# Altium schematic sheet pressure gage.SchDoc
size A3
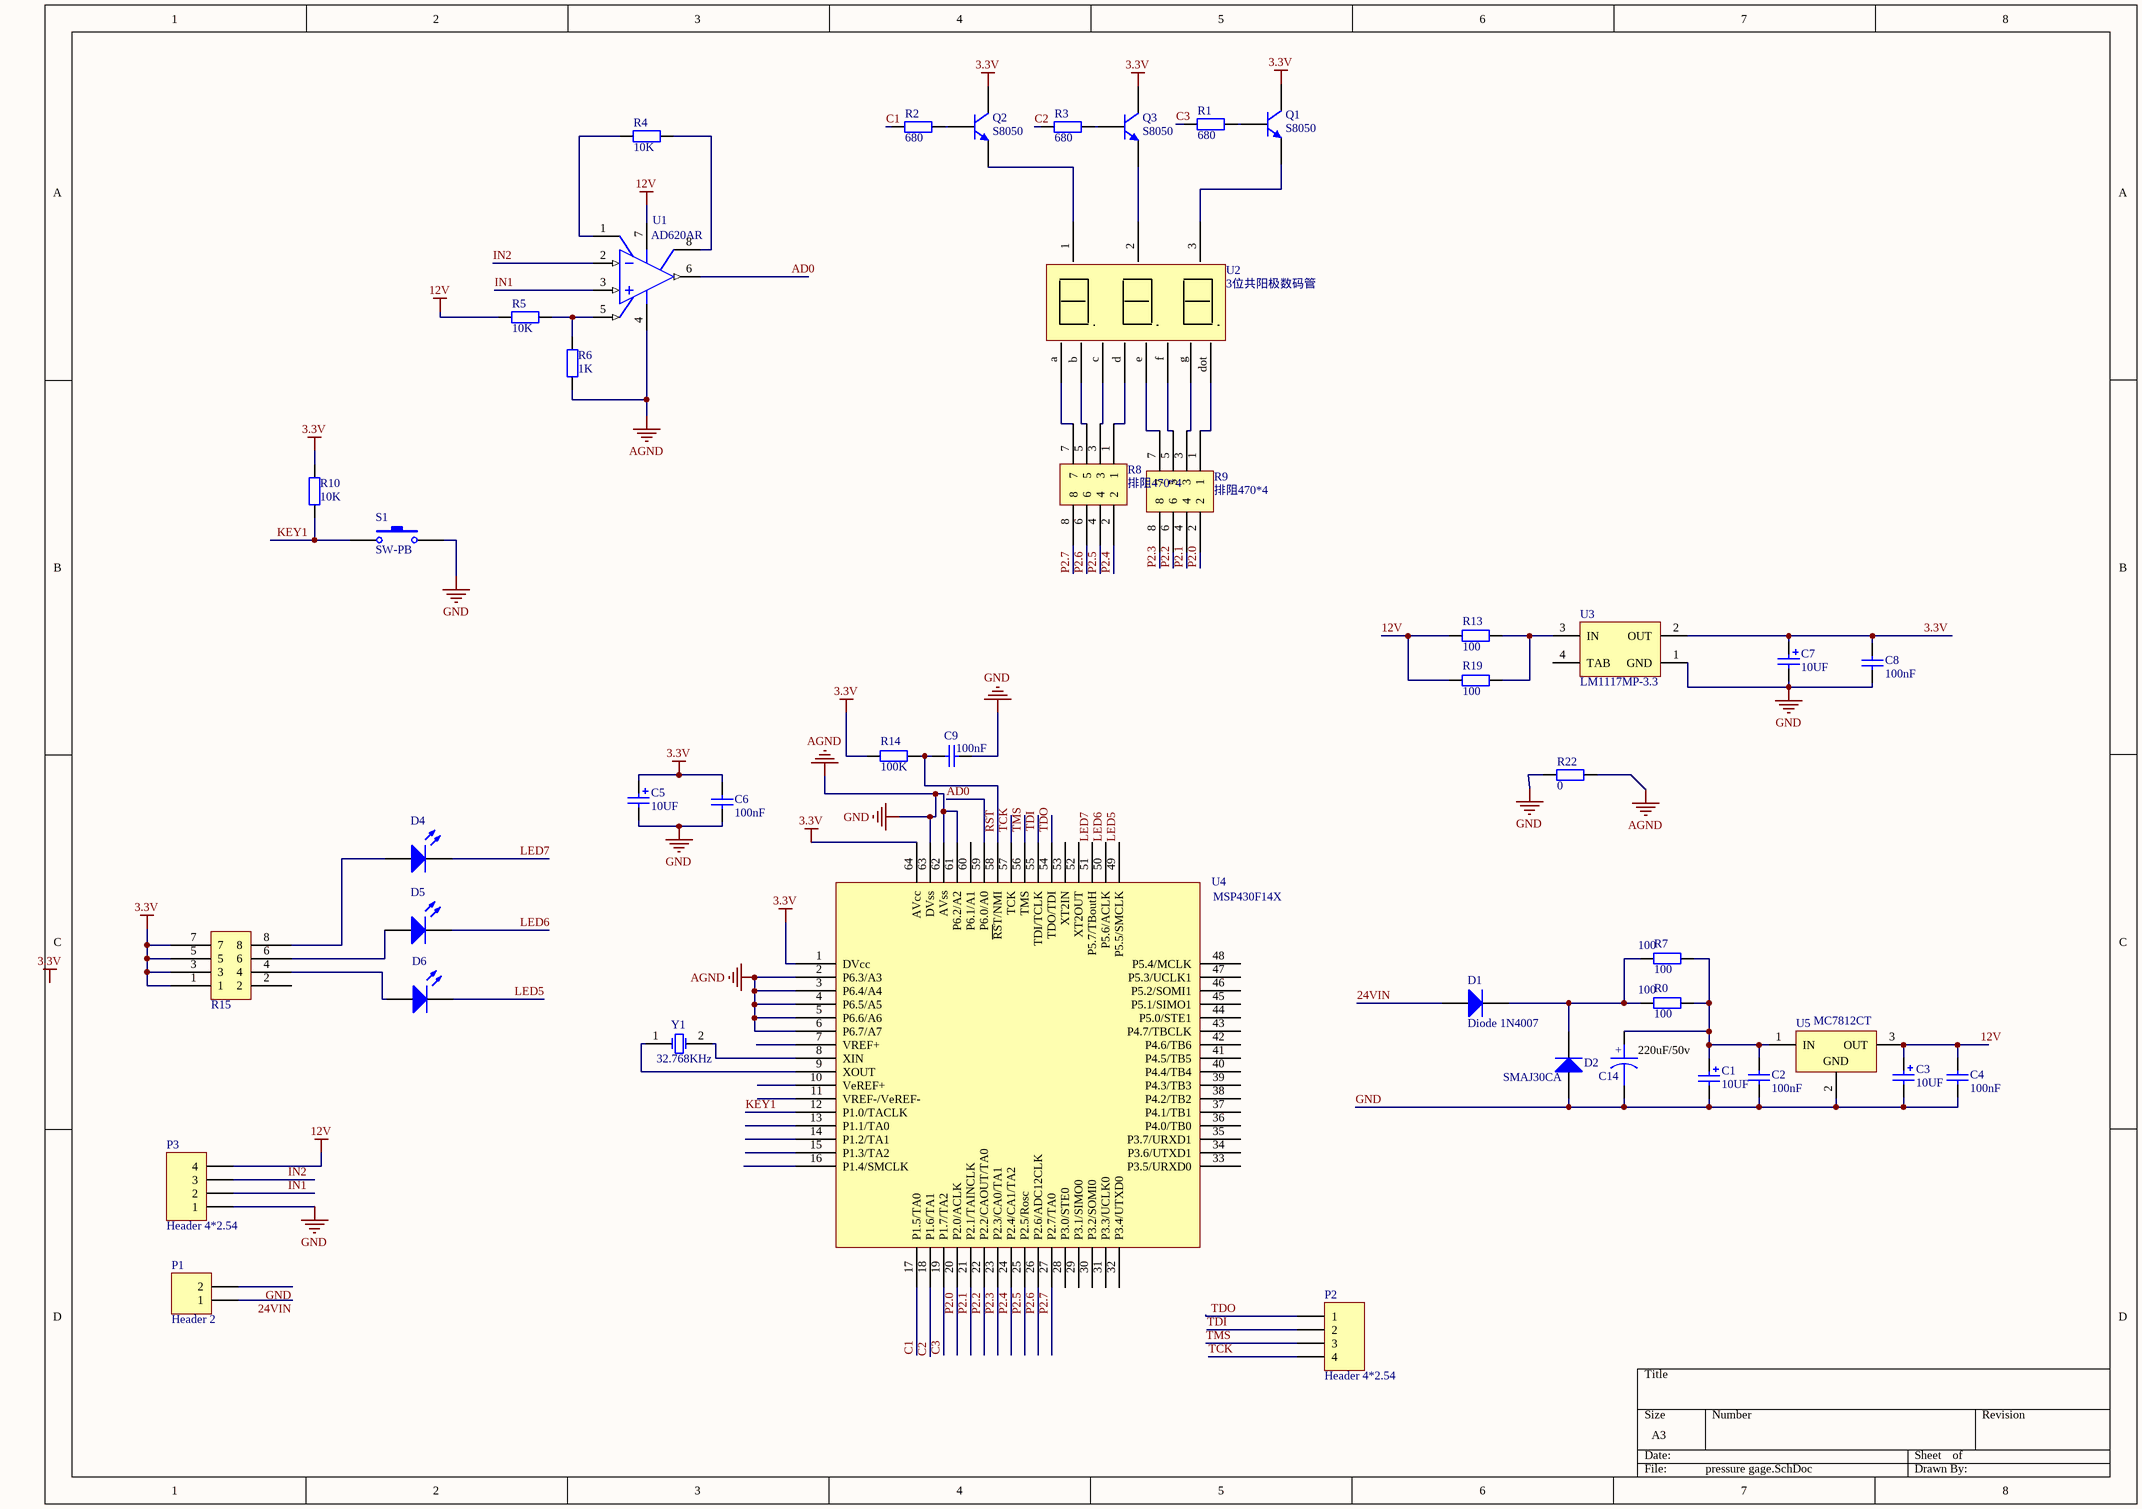
[diagram p0: pressure gage.SchDoc]

## Parts
C1  10uf  [3216]
C2  100nf  [0805_C_Y]
C3  10uf  [3216]
C4  100nf  [0805_C_Y]
C5  10uf  [3216]
C6  100nf  [0603AC]
C7  10uf  [3216]
C8  100nf  [0603AC]
C9  100nf  [0603AC]
C14  220uF/50v  [D50]
D1  Diode 1N4007  [DO-214]
D2  SMAJ30CA  [1812]
D4  LED  [LED]  (value not drawn)
D5  LED  [LED]  (value not drawn)
D6  LED  [LED]  (value not drawn)
P1  Header 2  [HDR1X2]
P2  Header 4*2.54  [HDR1X4]
P3  Header 4*2.54  [HDR1X4]
Q1  S8050  [SOT-23_Y]
Q2  S8050  [SOT-23_Y]
Q3  S8050  [SOT-23_Y]
R0  100  [1206]
R1  value 680  [0603AR]  (hidden comment: 330)
R2  value 680  [0603AR]  (hidden comment: 330)
R3  value 680  [0603AR]  (hidden comment: 330)
R4  10k  [0603AR]
R5  10k  [0603AR]
R6  1k  [0603AR]
R7  100  [1206]
R8  排阻470*4  [8P4R_0603]
R9  排阻470*4  [8P4R_0603]
R10  value 10K  [0603]  (hidden comment: 1k)
R13  100  [1206]
R14  100k  [0603AR]
R15  排阻470*4  [8P4R_0603]  (value not drawn)
R19  100  [1206]
R22  0  [0603AR]
S1  SW-PB  [SW-SMD1]
U1  AD620AR  [SO-8_Y]
U2  3位共阳极数码管  [3位数码管0.56]
U3  LM1117MP-3.3  [SOT89M]
U4  MSP430F14X  [S-PQFP-G64_Y]
U5  MC7812CT  [SOT89M]
Y1  value 32.768KHz  [Crastal_32.768_Y]  (hidden comment: 晶振32.768k)

## Nets
3.3V: C5.1 C6.1 C7.1 C8.1 Q1.3(C) Q2.3(C) Q3.3(C) R10.2 R14.1 R15.1 R15.3 R15.5 R15.7 U3.2(OUT) U4.1(DVcc) U4.64(AVcc)
12V: C3.1 C4.1 P3.4 R5.2 R13.1 R19.1 U1.7(V+) U5.3(OUT)
GND: C1.2 C2.2 C3.2 C4.2 C5.2 C6.2 C7.2 C8.2 C9.1 C14.2 D2.1(A) P1.2 P3.1 R6.1 R22.1 R22.2 S1.2 U1.4(V-) U3.1(GND) U4.2(P6.3/A3) U4.3(P6.4/A4) U4.4(P6.5/A5) U4.5(P6.6/A6) U4.6(P6.7/A7) U4.61(P6.2/A2) U4.62(AVss) U4.63(DVss) U5.2(GND)  [also labelled AGND]
24VIN: D1.1(A) P1.1
AD0: U1.6(OUT) U4.59(P6.0/A0)
C1: R2.2 U4.17(P1.5/TA0)
C2: R3.2 U4.18(P1.6/TA1)
C3: R1.2 U4.19(P1.7/TA2)
IN1: P3.2 U1.3(+IN)
IN2: P3.3 U1.2(-IN)
KEY1: R10.1 S1.1 U4.12(P1.0/TACLK)
LED5: D6.2(K) U4.49(P5.5/SMCLK)
LED6: D5.2(K) U4.50(P5.6/ACLK)
LED7: D4.2(K) U4.51(P5.7/TBoutH)
P2.0: R9.2 U4.20(P2.0/ACLK)
P2.1: R9.4 U4.21(P2.1/TAINCLK)
P2.2: R9.6 U4.22(P2.2/CAOUT/TA0)
P2.3: R9.8 U4.23(P2.3/CA0/TA1)
P2.4: R8.2 U4.24(P2.4/CA1/TA2)
P2.5: R8.4 U4.25(P2.5/Rosc)
P2.6: R8.6 U4.26(P2.6/ADC12CLK)
P2.7: R8.8 U4.27(P2.7/TA0)
RST: C9.2 R14.2 U4.58(~{RS}T/NMI)
TCK: P2.4 U4.57(TCK)
TDI: P2.2 U4.55(TDI/TCLK)
TDO: P2.1 U4.54(TDO/TDI)
TMS: P2.3 U4.56(TMS)
NetC1_1: C1.1 C2.1 C14.1 R0.2 R7.2 U5.1(IN)
NetD1_2: D1.2(K) D2.2(K) R0.1 R7.1
NetD4_1: D4.1(A) R15.8
NetD5_1: D5.1(A) R15.6
NetD6_1: D6.1(A) R15.4
NetQ1_1: Q1.1(B) R1.1
NetQ1_2: Q1.2(E) U2.3
NetQ2_1: Q2.1(B) R2.1
NetQ2_2: Q2.2(E) U2.1
NetQ3_1: Q3.1(B) R3.1
NetQ3_2: Q3.2(E) U2.2
NetR4_1: R4.1 U1.1(RG)
NetR4_2: R4.2 U1.8(RG)
NetR5_1: R5.1 R6.2 U1.5(REF)
NetR8_1: R8.1 U2.d
NetR8_3: R8.3 U2.c
NetR8_5: R8.5 U2.b
NetR8_7: R8.7 U2.a
NetR9_1: R9.1 U2.dot
NetR9_3: R9.3 U2.g
NetR9_5: R9.5 U2.f
NetR9_7: R9.7 U2.e
NetR13_2: R13.2 R19.2 U3.3(IN)
NetU4_8: U4.8(XIN) Y1.2(OSC2)
NetU4_9: U4.9(XOUT) Y1.1(OSC1)

Not connected (* = marked no-connect by the designer): R15 2; U3 4(TAB); U4 7(VREF+) 10(VeREF+) 11(VREF-/VeREF-) 13(P1.1/TA0) 14(P1.2/TA1) 15(P1.3/TA2) 16(P1.4/SMCLK) 28(P3.0/STE0) 29(P3.1/SIMO0) 30(P3.2/SOMI0) 31(P3.3/UCLK0) 32(P3.4/UTXD0) 33(P3.5/URXD0) 34(P3.6/UTXD1) 35(P3.7/URXD1) 36(P4.0/TB0) 37(P4.1/TB1) 38(P4.2/TB2) 39(P4.3/TB3) 40(P4.4/TB4) 41(P4.5/TB5) 42(P4.6/TB6) 43(P4.7/TBCLK) 44(P5.0/STE1) 45(P5.1/SIMO1) 46(P5.2/SOMI1) 47(P5.3/UCLK1) 48(P5.4/MCLK) 52(XT2OUT) 53(XT2IN) 60(P6.1/A1)

## Notes on the sheet
- Labels drawn without touching a wire or pin: 3.3V
- (in symbol CAPACITOR POL) +

## Library data of the parts
C1 C3 C5 C7 = Cap Pol2: Polarized Capacitor (Axial); Published: 8-Jun-2000; LatestRevisionDate: 17-Jul-2002; LatestRevisionNote: Re-released for DXP Platform.; PackageReference: POLAR0.8; Publisher: Altium Limited; Value: 10UF
C2 C4 C6 C8 C9 = Cap: Capacitor; Published: 8-Jun-2000; LatestRevisionDate: 17-Jul-2002; LatestRevisionNote: Re-released for DXP Platform.; PackageReference: RAD-0.3; Publisher: Altium Limited; Value: 100nF
C14 = CAPACITOR POL: Capacitor
D1 = Diode 1N4007: 1 Amp General Purpose Rectifier; Published: 8-Jun-2000; LatestRevisionDate: 17-Jul-2002; LatestRevisionNote: Re-released for DXP Platform.; DatasheetVersion: 1998; PackageVersion: Aug-1999; PackageReference: DO-41; Publisher: Altium Limited; Code_JEDEC: DO-204-AL; ComponentLink1Description: Manufacturer Link; ComponentLink1URL: http://www.fairchildsemi.com/; ComponentLink2Description: Datasheet; ComponentLink2URL: http://www.fairchildsemi.com/ds/1N%2F1N4001.pdf
D2 = Diode 1N5402: 3 Amp General Purpose Rectifier; Published: 8-Jun-2000; LatestRevisionDate: 17-Jul-2002; LatestRevisionNote: Re-released for DXP Platform.; DatasheetVersion: 1998; PackageVersion: Aug-1999; PackageReference: DO-201AD; Publisher: Altium Limited; ComponentLink1Description: Manufacturer Link; ComponentLink1URL: http://www.fairchildsemi.com/; ComponentLink2Description: Datasheet; ComponentLink2URL: http://www.fairchildsemi.com/ds/1N%2F1N5400.pdf
D4-D6 = LED0: Typical INFRARED GaAs LED; Published: 8-Jun-2000; LatestRevisionDate: 08-Jul-2005; LatestRevisionNote: Mech Layer 1 removed.; PackageReference: LED-0; Publisher: Altium Limited
P1 = Header 2: Header, 2-Pin; LatestRevisionDate: 17-Jul-2002; LatestRevisionNote: Re-released for DXP Platform.; Publisher: Altium Limited
P2 P3 = Header 4: Header, 4-Pin; LatestRevisionDate: 17-Jul-2002; LatestRevisionNote: Re-released for DXP Platform.; Publisher: Altium Limited
Q1-Q3 = 2N3904: NPN General Purpose Amplifier; Published: 8-Jun-2000; LatestRevisionDate: 15-Jan-2003; LatestRevisionNote: PCB Footprint 'BCY-W3/D4.7' replaced; DatasheetVersion: 1997; PackageVersion: Sep-1998; PackageReference: TO-92A; Publisher: Altium Limited; Code_JEDEC: TO-92A; ComponentLink1Description: Manufacturer Link; ComponentLink1URL: http://www.fairchildsemi.com/; ComponentLink2Description: Datasheet; ComponentLink2URL: http://www.fairchildsemi.com/ds/2N%2F2N3904.pdf
R0-R7 R10 R13 R14 R19 R22 = Res2: Resistor; Published: 8-Jun-2000; LatestRevisionDate: 17-Jul-2002; LatestRevisionNote: Re-released for DXP Platform.; PackageReference: AXIAL-0.4; Publisher: Altium Limited
  R0 R7 R13 R19: Value: 100
  R4 R5: Value: 10K
  R6: Value: 1K
  R14: Value: 100K
  R22: Value: 0
R8 R9 R15 = 排阻 8P4R: Value: 470
S1 = SW-PB: Switch; Published: 24-Mar-1999; LatestRevisionDate: 17-Jul-2002; LatestRevisionNote: Re-released for DXP Platform.; PackageReference: SPST-2; Publisher: Altium Limited
U1 = AD620AR: Low-Cost, Low-Power Instrumentation Amplifier; Published: 8-Jun-2000; LatestRevisionDate: 13-Apr-2006; LatestRevisionNote: IPC-7351 Footprint Added.; DatasheetVersion: REV.D 1998; PackageVersion: 1998; PackageReference: R-8D; Publisher: Altium Limited; PackageDescription: 8-Pin Narrow Body Small Outline Integrated Circuit 1.27 mm Pitch; ComponentLink1Description: Manufacturer Link; ComponentLink1URL: http://www.analog.com/en/prod/0%2C2877%2CAD620%2C00.html; ComponentLink2Description: Datasheet; ComponentLink2URL: http://www.analog.com/UploadedFiles/Data_Sheets/897653854AD620_g.pdf
U3 = LM1117MP-3.3: 800mA Low-Dropout Linear Regulator; Manufacturer: National Semiconductor; CompType: LDO IC; PackageTopMarking: XYTT*N05A; PowerWise: N; Published: 4-Dec-2008; DatasheetVersion: Apr-2006; PackageVersion: revB, Apr-2003; PackageReference: MP04A; Publisher: Altium Limited; PackageDescription: Molded SOT-223, 6.50 x 3.56 x 1.6mm Body, 4 Lead, 2.3mm Pitch; PartNumber: LM1117MP-3.3; RoHS: O; PinCount: 4; DigiKeyPartNumber: LM1117MP-3.3CT-ND; Code_JEDEC: TO-261-AA; Code_IPC: SOT223-4; ComponentLink1Description: LM1117 Datasheet; ComponentLink1URL: http://www.national.com/ds/LM/LM1117.pdf; ComponentLink2Description: LM1117 Web Page; ComponentLink2URL: http://www.national.com/pf/LM/LM1117.html; ComponentLink3Description: MP04A Package Page; ComponentLink3URL: http://www.national.com/packaging/folders/mp04a.html
U5 = MC7812CT: Three-Terminal Positive Voltage Regulator; pin to pad: 1>3 3>1; Note: Heatsink surface is connected to Pin 2; Published: 15-Apr-2002; DatasheetVersion: 1997; PackageVersion: 1997; PackageReference: 221A-06; Publisher: Altium Limited; PackageDescription: TO, Thru-Hole, Vertical, Heatsink Mounted; 3 In-Line Leads; Pitch 2.54 mm; Code_JEDEC: TO-262-AA; ComponentLink1Description: Manufacturer Link; ComponentLink1URL: http://www.onsemi.com/site/products/taxonomy/0,4438,503,00.html; ComponentLink2Description: Datasheet; ComponentLink2URL: http://www.onsemi.com/pub/Collateral/MC7800-D.PDF
Y1 = XTAL: Crystal Oscillator; Published: 8-Jun-2000; LatestRevisionDate: 17-Jul-2002; LatestRevisionNote: Re-released for DXP Platform.; PackageReference: R38; Publisher: Altium Limited